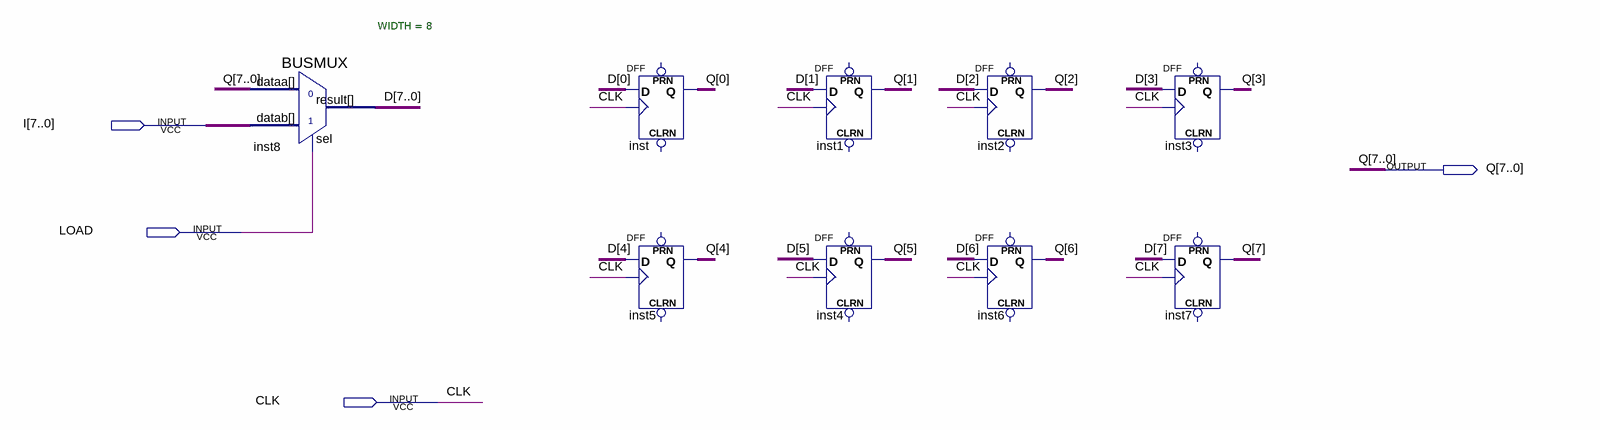
[diagram p0: schematic sheet]
// Quartus schematic REGISTERwLOAD.bdf as structural Verilog: 9 symbols, 4 pins
module REGISTERwLOAD (
  input  [7:0] I,
  input  LOAD,
  input  CLK,
  output [7:0] Q
);

  wire [7:0] D;

  BUSMUX #(.WIDTH(8)) inst8 (.datab(I), .sel(LOAD), .dataa(Q), .result(D));
  DFF inst (.CLK(CLK), .D(D[0]), .Q(Q[0]));  // open: CLRN, PRN
  DFF inst5 (.CLK(CLK), .D(D[4]), .Q(Q[4]));  // open: CLRN, PRN
  DFF inst1 (.CLK(CLK), .D(D[1]), .Q(Q[1]));  // open: CLRN, PRN
  DFF inst4 (.CLK(CLK), .D(D[5]), .Q(Q[5]));  // open: CLRN, PRN
  DFF inst2 (.CLK(CLK), .D(D[2]), .Q(Q[2]));  // open: CLRN, PRN
  DFF inst6 (.CLK(CLK), .D(D[6]), .Q(Q[6]));  // open: CLRN, PRN
  DFF inst3 (.CLK(CLK), .D(D[3]), .Q(Q[3]));  // open: CLRN, PRN
  DFF inst7 (.CLK(CLK), .D(D[7]), .Q(Q[7]));  // open: CLRN, PRN
endmodule
